# EAGLE design Atmega328p_sismin_attempt_3 (EAGLE 9.6.2)
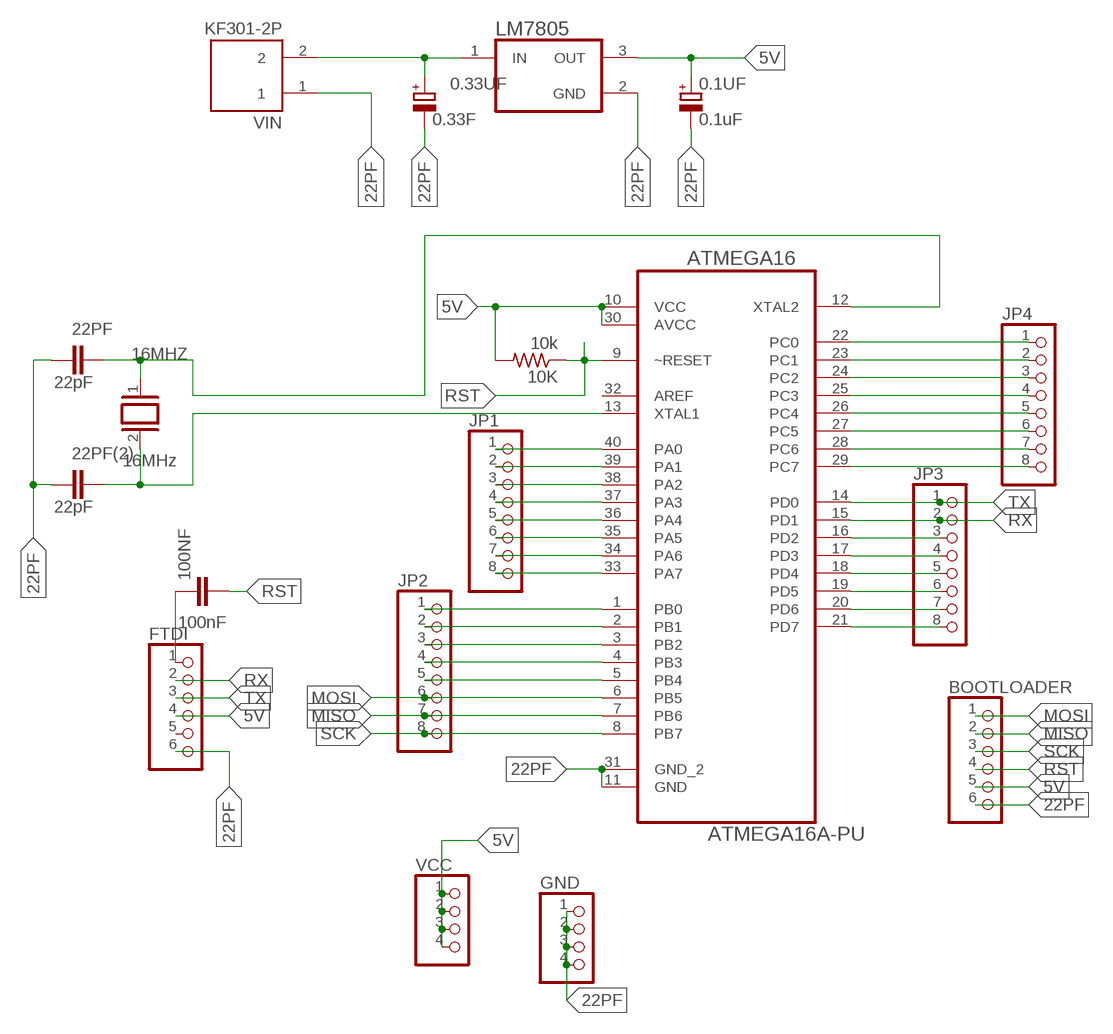
[diagram p0: schematic, sheet 1]

## Parts
0.1UF  0.1uF  CPOL-EUE2.5-6  [E2,5-6]
0.33UF  0.33F  CPOL-EUE2.5-6  [E2,5-6]
10K  10k  R-US_0207/7  [0207/7]
16MHZ  16MHz  XTAL/S  [QS]
22PF  22pF  C2,5-3  [C2.5-3]
22PF(2)  22pF  C2,5-3  [C2.5-3]
100NF  100nF  C-EU050-025X075  [C050-025X075]
ATMEGA16  ATMEGA16A-PU  [DIP254P1524X482-40]
BOOTLOADER  PINHD-1X6  [1X06]
FTDI  PINHD-1X6  [1X06]
GND  PINHD-1X4  [1X04]
JP1  PINHD-1X8  [1X08]
JP2  PINHD-1X8  [1X08]
JP3  PINHD-1X8  [1X08]
JP4  PINHD-1X8  [1X08]
LM7805  LM7805CT/NOPB  [TO254P1054X470X2600-3]
VCC  PINHD-1X4  [1X04]
VIN  KF301-2P  [HANDSON_KF301-2P]

## Nets
5V: 0.1UF.+ 10K.2 ATMEGA16.10(VCC) ATMEGA16.30(AVCC) BOOTLOADER.5 FTDI.4 LM7805.3(OUT) VCC.1 VCC.2 VCC.3 VCC.4
22PF: 0.1UF.- 0.33UF.- 22PF(2).2 22PF.2 ATMEGA16.11(GND) ATMEGA16.31(GND_2) BOOTLOADER.6 FTDI.6 GND.1 GND.2 GND.3 GND.4 LM7805.2(GND) VIN.1
MISO: ATMEGA16.7(PB6) BOOTLOADER.2 JP2.7
MOSI: ATMEGA16.6(PB5) BOOTLOADER.1 JP2.6
N$1: 16MHZ.1 22PF.1 ATMEGA16.12(XTAL2)
N$2: 16MHZ.2 22PF(2).1 ATMEGA16.13(XTAL1)
N$3: 0.33UF.+ LM7805.1(IN) VIN.2
N$5: ATMEGA16.40(PA0) JP1.1
N$6: ATMEGA16.39(PA1) JP1.2
N$7: ATMEGA16.38(PA2) JP1.3
N$8: ATMEGA16.37(PA3) JP1.4
N$9: ATMEGA16.36(PA4) JP1.5
N$10: ATMEGA16.35(PA5) JP1.6
N$11: ATMEGA16.34(PA6) JP1.7
N$12: ATMEGA16.33(PA7) JP1.8
N$13: ATMEGA16.1(PB0) JP2.1
N$14: ATMEGA16.2(PB1) JP2.2
N$15: ATMEGA16.3(PB2) JP2.3
N$16: ATMEGA16.4(PB3) JP2.4
N$17: ATMEGA16.5(PB4) JP2.5
N$21: ATMEGA16.22(PC0) JP4.1
N$22: ATMEGA16.23(PC1) JP4.2
N$23: ATMEGA16.24(PC2) JP4.3
N$24: ATMEGA16.25(PC3) JP4.4
N$25: ATMEGA16.26(PC4) JP4.5
N$26: ATMEGA16.27(PC5) JP4.6
N$27: ATMEGA16.28(PC6) JP4.7
N$28: ATMEGA16.29(PC7) JP4.8
N$31: ATMEGA16.16(PD2) JP3.3
N$32: ATMEGA16.17(PD3) JP3.4
N$33: ATMEGA16.18(PD4) JP3.5
N$34: ATMEGA16.19(PD5) JP3.6
N$35: ATMEGA16.20(PD6) JP3.7
N$36: ATMEGA16.21(PD7) JP3.8
N$37: 100NF.1 FTDI.1
RST: 10K.1 100NF.2 ATMEGA16.9(~RESET) BOOTLOADER.4
RX: ATMEGA16.15(PD1) FTDI.2 JP3.2
SCK: ATMEGA16.8(PB7) BOOTLOADER.3 JP2.8
TX: ATMEGA16.14(PD0) FTDI.3 JP3.1
Unconnected: ATMEGA16.32(AREF) FTDI.5

## Library data of the parts
0.1UF 0.33UF = rcl:CPOL-EU: POLARIZED CAPACITOR, European symbol; SPICEPREFIX: C
10K = rcl:R-US_: RESISTOR, American symbol; SPICEPREFIX: R
16MHZ = special:XTAL/S: CRYSTAL
22PF 22PF(2) = capacitor-wima:C: CAPACITOR naming: grid - package width
100NF = rcl:C-EU: CAPACITOR, European symbol; SPICEPREFIX: C
ATMEGA16 = ATMEGA16A-PU:ATMEGA16A-PU: 8-bit Microcontroller with 16K Bytes In-System Programmable Flash Check availability <https://pricing.snapeda.com/parts/ATMEGA16A-PU/Microchip/view-part?ref=eda>; AVAILABILITY: In Stock; DESCRIPTION: AVR AVR® ATmega Microcontroller IC 8-Bit 16MHz 16KB (8K x 16) FLASH 40-PDIP; MF: Microchip; MP: ATMEGA16A-PU; PACKAGE: DIP-40 Microchip Technology; PRICE: None; PURCHASE-URL: https://pricing.snapeda.com/search?q=ATMEGA16A-PU&ref=eda
BOOTLOADER FTDI = pinhead:PINHD-1X6: PIN HEADER
GND VCC = pinhead:PINHD-1X4: PIN HEADER
JP1-JP4 = pinhead:PINHD-1X8: PIN HEADER
LM7805 = LM7805CT_NOPB:LM7805CT/NOPB: Standard Regulator Pos 5V 1A 3-Pin(3+Tab) TO-220 Rail Check availability <https://pricing.snapeda.com/parts/LM7805CT/ON%20Semiconductor/view-part?ref=eda>; AVAILABILITY: In Stock; DESCRIPTION: Linear Voltage Regulator IC Positive Fixed 1 Output 1.5A TO-220-3; MF: ON Semiconductor; MP: LM7805CT; PACKAGE: TO-220-3 ON Semiconductor; PRICE: None; PURCHASE-URL: https://pricing.snapeda.com/search/part/LM7805CT/?ref=eda
VIN = KF301-2P:KF301-2P: 2 Pin Terminal Block 5mm Pitch Check availability <https://pricing.snapeda.com/parts/KF301-2P/Handson%20Technology/view-part?ref=eda>; AVAILABILITY: Not in stock; DESCRIPTION: 2 Pin Terminal Block 5mm Pitch; MF: Handson Technology; MP: KF301-2P; PACKAGE: None; PRICE: None

## Board
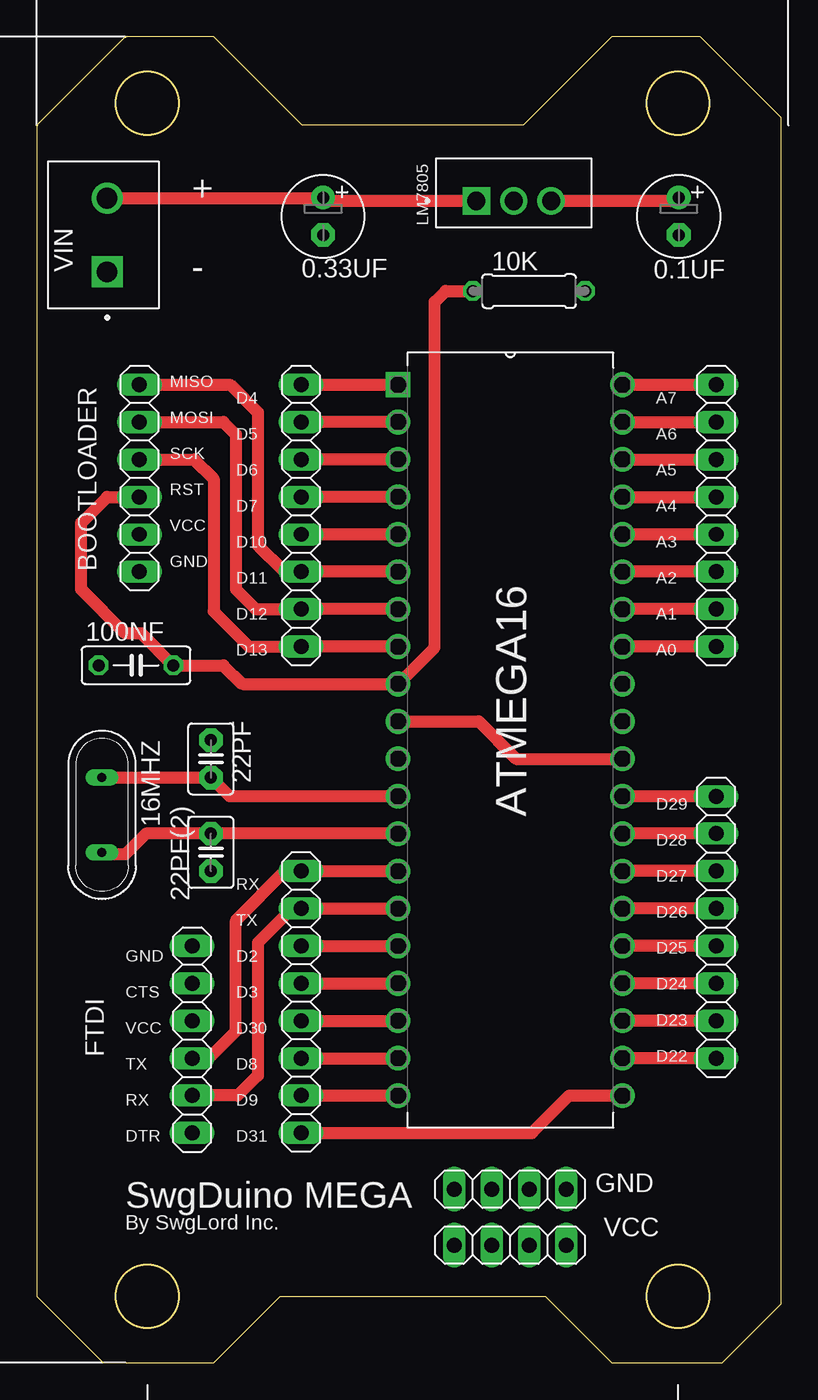
[diagram p1: board, top side]
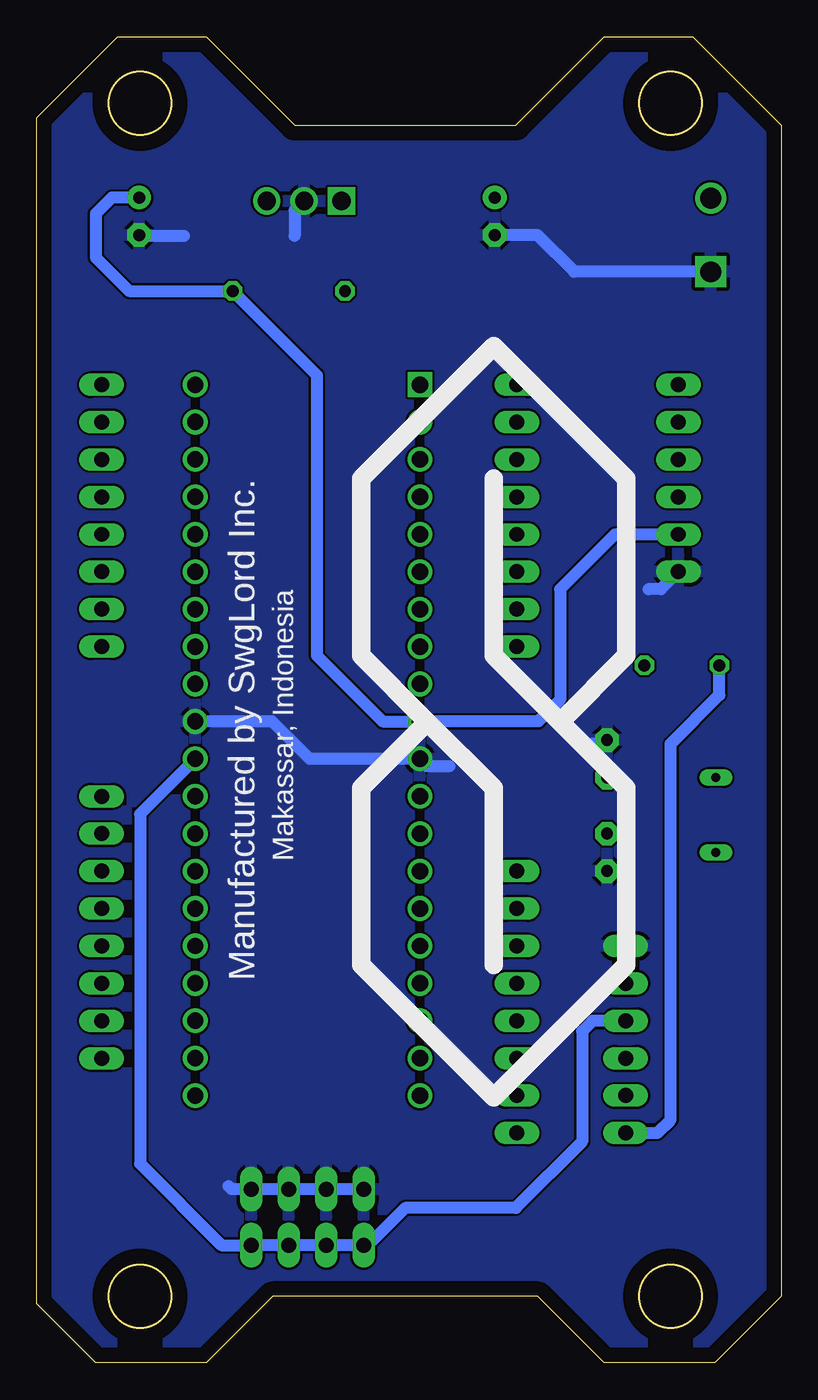
[diagram p2: board, bottom side, seen from below]

Size 50.5 x 90 mm. Coordinates in mm from the lower left corner, seen from the top.
Outline: 0,4.5 4.5,0 12,0 16.5,4.5 34.5,4.5 39,0 46.5,0 50.5,4 50.5,84.5 45,90 39,90 33,84 18,84 12,90 6,90 0,84 0,4.5
Outline: circle at 43.5,85.5 radius 2.12
Outline: circle at 7.5,85.5 radius 2.12
Outline: circle at 43.5,4.5 radius 2.12
Outline: circle at 7.5,4.5 radius 2.12
Copper layers (1*16): Top 0.035mm / dielectric 1.5mm / Bottom 0.035mm
Design rules "default": minimum track width 6mil, minimum drill 0.35mm, track to track 6mil, track to pad 6mil, pad to pad 6mil, via to via 6mil, smd to smd 6mil, copper to edge 40mil, drill to drill 6mil, minimum pad ring 10mil, minimum via ring 8mil, stop-mask expansion 4mil, vias tented up to drill 0mil, thermal gap 10mil

### Footprints (pad centres in the part's own frame; a part is rotated, then mirrored left to right if it is on the bottom)
E2,5-6 = drill 0.813 pad 1.6: + -1.27,0 | drill 0.813 pad 1.6 octagon: - 1.27,0
0207/7 = drill 0.813 octagon: 1 -3.81,0; 2 3.81,0
QS = drill 0.61 long: 1 -2.54,0; 2 2.54,0
C2.5-3 = drill 0.813 pad 1.6 octagon: 1 -1.27,0; 2 1.27,0
C050-025X075 = drill 0.813 octagon: 1 -2.54,0; 2 2.54,0
DIP254P1524X482-40 = drill 1.118 square: 1 -15.24,48.26 | drill 1.118: 2 -15.24,45.72; 3 -15.24,43.18; 4 -15.24,40.64; 5 -15.24,38.1; 6 -15.24,35.56; 7 -15.24,33.02; 8 -15.24,30.48; 9 -15.24,27.94; 10 -15.24,25.4; 11 -15.24,22.86; 12 -15.24,20.32; 13 -15.24,17.78; 14 -15.24,15.24; 15 -15.24,12.7; 16 -15.24,10.16; 17 -15.24,7.62; 18 -15.24,5.08; 19 -15.24,2.54; 20 -15.24,0; 21 0,0; 22 0,2.54; 23 0,5.08; 24 0,7.62; 25 0,10.16; 26 0,12.7; 27 0,15.24; 28 0,17.78; 29 0,20.32; 30 0,22.86; 31 0,25.4; 32 0,27.94; 33 0,30.48; 34 0,33.02; 35 0,35.56; 36 0,38.1; 37 0,40.64; 38 0,43.18; 39 0,45.72; 40 0,48.26
1X06 = drill 1.016 long: 1 -6.35,0; 2 -3.81,0; 3 -1.27,0; 4 1.27,0; 5 3.81,0; 6 6.35,0
1X04 = drill 1.016 long: 1 -3.81,0; 2 -1.27,0; 3 1.27,0; 4 3.81,0
1X08 = drill 1.016 long: 1 -8.89,0; 2 -6.35,0; 3 -3.81,0; 4 -1.27,0; 5 1.27,0; 6 3.81,0; 7 6.35,0; 8 8.89,0
TO254P1054X470X2600-3 = drill 1.24 square: 1 0,0 | drill 1.24: 2 2.54,0; 3 5.08,0
HANDSON_KF301-2P = drill 1.4 square: 1 -2.5,0 | drill 1.4: 2 2.5,0

### Placement (x,y rotation side)
0.1UF  43.56,77.82 270 top
0.33UF  19.43,77.82 270 top
10K  33.4,72.74 0 top
16MHZ  4.42,37.18 270 top
22PF  11.81,40.99 90 top
22PF(2)  11.81,34.64 270 top
100NF  6.73,47.34 0 top
ATMEGA16  39.75,18.13 0 top
BOOTLOADER  6.96,60.04 270 top
FTDI  10.54,21.94 90 top
GND  32.13,11.78 180 top
JP1  46.1,57.5 270 top
JP2  17.93,57.5 270 top
JP3  17.93,24.48 270 top
JP4  46.1,29.56 90 top
LM7805  29.82,78.86 0 top
VCC  32.13,7.97 180 top
VIN  4.77,76.55 90 top

### Tracks (layer width: path | path; a pad name or v marks a point on that pad's centre or on a via)
5V
  Top 0.813: 0.1UF.+ 43.33,78.86 LM7805.3 | ATMEGA16.10 29.97,43.53 32.51,40.99 ATMEGA16.30
  Bottom 0.813: ATMEGA16.30 43.5,37.24 43.5,13.5 37.97,7.97 VCC.1 VCC.2 VCC.3 VCC.4 28.03,7.97 25.5,10.5 18,10.5 13.5,15 13.5,22.5 12.79,23.21 FTDI.4 | BOOTLOADER.5 11.27,56.23 15,52.5 15,45 16.47,43.53 ATMEGA16.10 27.03,43.53 31.5,48 31.5,67.03 10K.2 44.24,72.74 46.5,75 46.5,78 45.41,79.09 0.1UF.+
22PF
  Bottom 0.813: GND.4 GND.3 GND.2 GND.1 37.28,11.78 37.5,12 | ATMEGA16.31 34.53,43.53 31.99,40.99 ATMEGA16.11 24.02,40.5 22.5,40.5 | 22PF.2 12.07,42 13.5,42 | FTDI.6 10.75,28.5 | BOOTLOADER.6 8.15,52.5 9,52.5 | VIN.1 14.05,74.05 16.55,76.55 0.33UF.- | LM7805.2 33,78.22 33,76.5 | 0.1UF.- 43.51,76.5 40.5,76.5
  pour Bottom: -4.5,87 3,94.5 52.5,94.5 56.83,90.17 56.83,-7.5 -4.5,-7.5
MISO
  Top 0.813: ATMEGA16.7 JP2.7 14.85,51.15 13.5,52.5 13.5,63 12.65,63.85 BOOTLOADER.2
MOSI
  Top 0.813: ATMEGA16.6 JP2.6 16.81,53.69 15,55.5 15,64.5 13.11,66.39 BOOTLOADER.1
N$1
  Top 0.813: ATMEGA16.12 13.08,38.45 22PF.1 16MHZ.1
N$2
  Top 0.813: ATMEGA16.13 22PF(2).1 7.41,35.91 6,34.5 4.56,34.5 16MHZ.2
N$3
  Top 0.813: VIN.2 19.39,79.05 0.33UF.+ 19.66,78.86 LM7805.1
N$5
  Top 0.813: ATMEGA16.40 JP1.1
N$6
  Top 0.813: ATMEGA16.39 JP1.2
N$7
  Top 0.813: ATMEGA16.38 JP1.3
N$8
  Top 0.813: ATMEGA16.37 JP1.4
N$9
  Top 0.813: JP1.5 ATMEGA16.36
N$10
  Top 0.813: JP1.6 ATMEGA16.35
N$11
  Top 0.813: JP1.7 ATMEGA16.34
N$12
  Top 0.813: JP1.8 ATMEGA16.33
N$13
  Top 0.813: JP2.1 ATMEGA16.1
N$14
  Top 0.813: ATMEGA16.2 JP2.2
N$15
  Top 0.813: ATMEGA16.3 JP2.3
N$16
  Top 0.813: ATMEGA16.4 JP2.4
N$17
  Top 0.813: ATMEGA16.5 JP2.5
N$21
  Top 0.813: JP4.1 ATMEGA16.22
N$22
  Top 0.813: JP4.2 ATMEGA16.23
N$23
  Top 0.813: JP4.3 ATMEGA16.24
N$24
  Top 0.813: JP4.4 ATMEGA16.25
N$25
  Top 0.813: JP4.5 ATMEGA16.26
N$26
  Top 0.813: JP4.6 ATMEGA16.27
N$27
  Top 0.813: JP4.7 ATMEGA16.28
N$28
  Top 0.813: JP4.8 ATMEGA16.29
N$31
  Top 0.813: JP3.3 ATMEGA16.16
N$32
  Top 0.813: JP3.4 ATMEGA16.17
N$33
  Top 0.813: JP3.5 ATMEGA16.18
N$34
  Top 0.813: JP3.6 ATMEGA16.19
N$35
  Top 0.813: JP3.7 ATMEGA16.20
N$36
  Top 0.813: JP3.8 33.59,15.59 36.13,18.13 ATMEGA16.21
N$37
  Bottom 0.813: FTDI.1 8.41,15.59 7.5,16.5 7.5,42 4.19,45.31 100NF.1
RST
  Top 0.813: 10K.1 27.74,72.74 27,72 27,48.56 ATMEGA16.9 13.93,46.07 12.66,47.34 100NF.2 7.11,49.5 6,49.5 3,52.5 3,57 4.77,58.77 BOOTLOADER.4
RX
  Top 0.813: ATMEGA16.15 JP3.2 17.33,30.83 15,28.5 15,19.5 13.63,18.13 FTDI.2
SCK
  Top 0.813: ATMEGA16.8 JP2.8 14.39,48.61 12,51 12,60 10.69,61.31 BOOTLOADER.3
TX
  Top 0.813: ATMEGA16.14 JP3.1 16.87,33.37 13.5,30 13.5,22.5 11.67,20.67 FTDI.3

### Text on the board
tPlace: + / / -
bPlace: Manufactured by SwgLord Inc. | Makassar, Indonesia
tNames: MISO / / MOSI / / SCK / / RST / / VCC / / GND | D4 / / D5 / / D6 / / D7 / / D10 / / D11 / / D12 / / D13 | A7 / / A6 / / A5 / / A4 / / A3 / / A2 / / A1 / / A0 | D29 / / D28 / / D27 / / D26 / / D25 / / D24 / / D23 / / D22 | GND / / CTS / / VCC / / TX / / RX / / DTR | RX / / TX / / D2 / / D3 / / D30 / / D8 / / D9 / / D31 | SwgDuino MEGA | By SwgLord Inc.